# EasyEDA Pro project Space_Hexapod_hw_v1.eprj, board Space_Hexapod
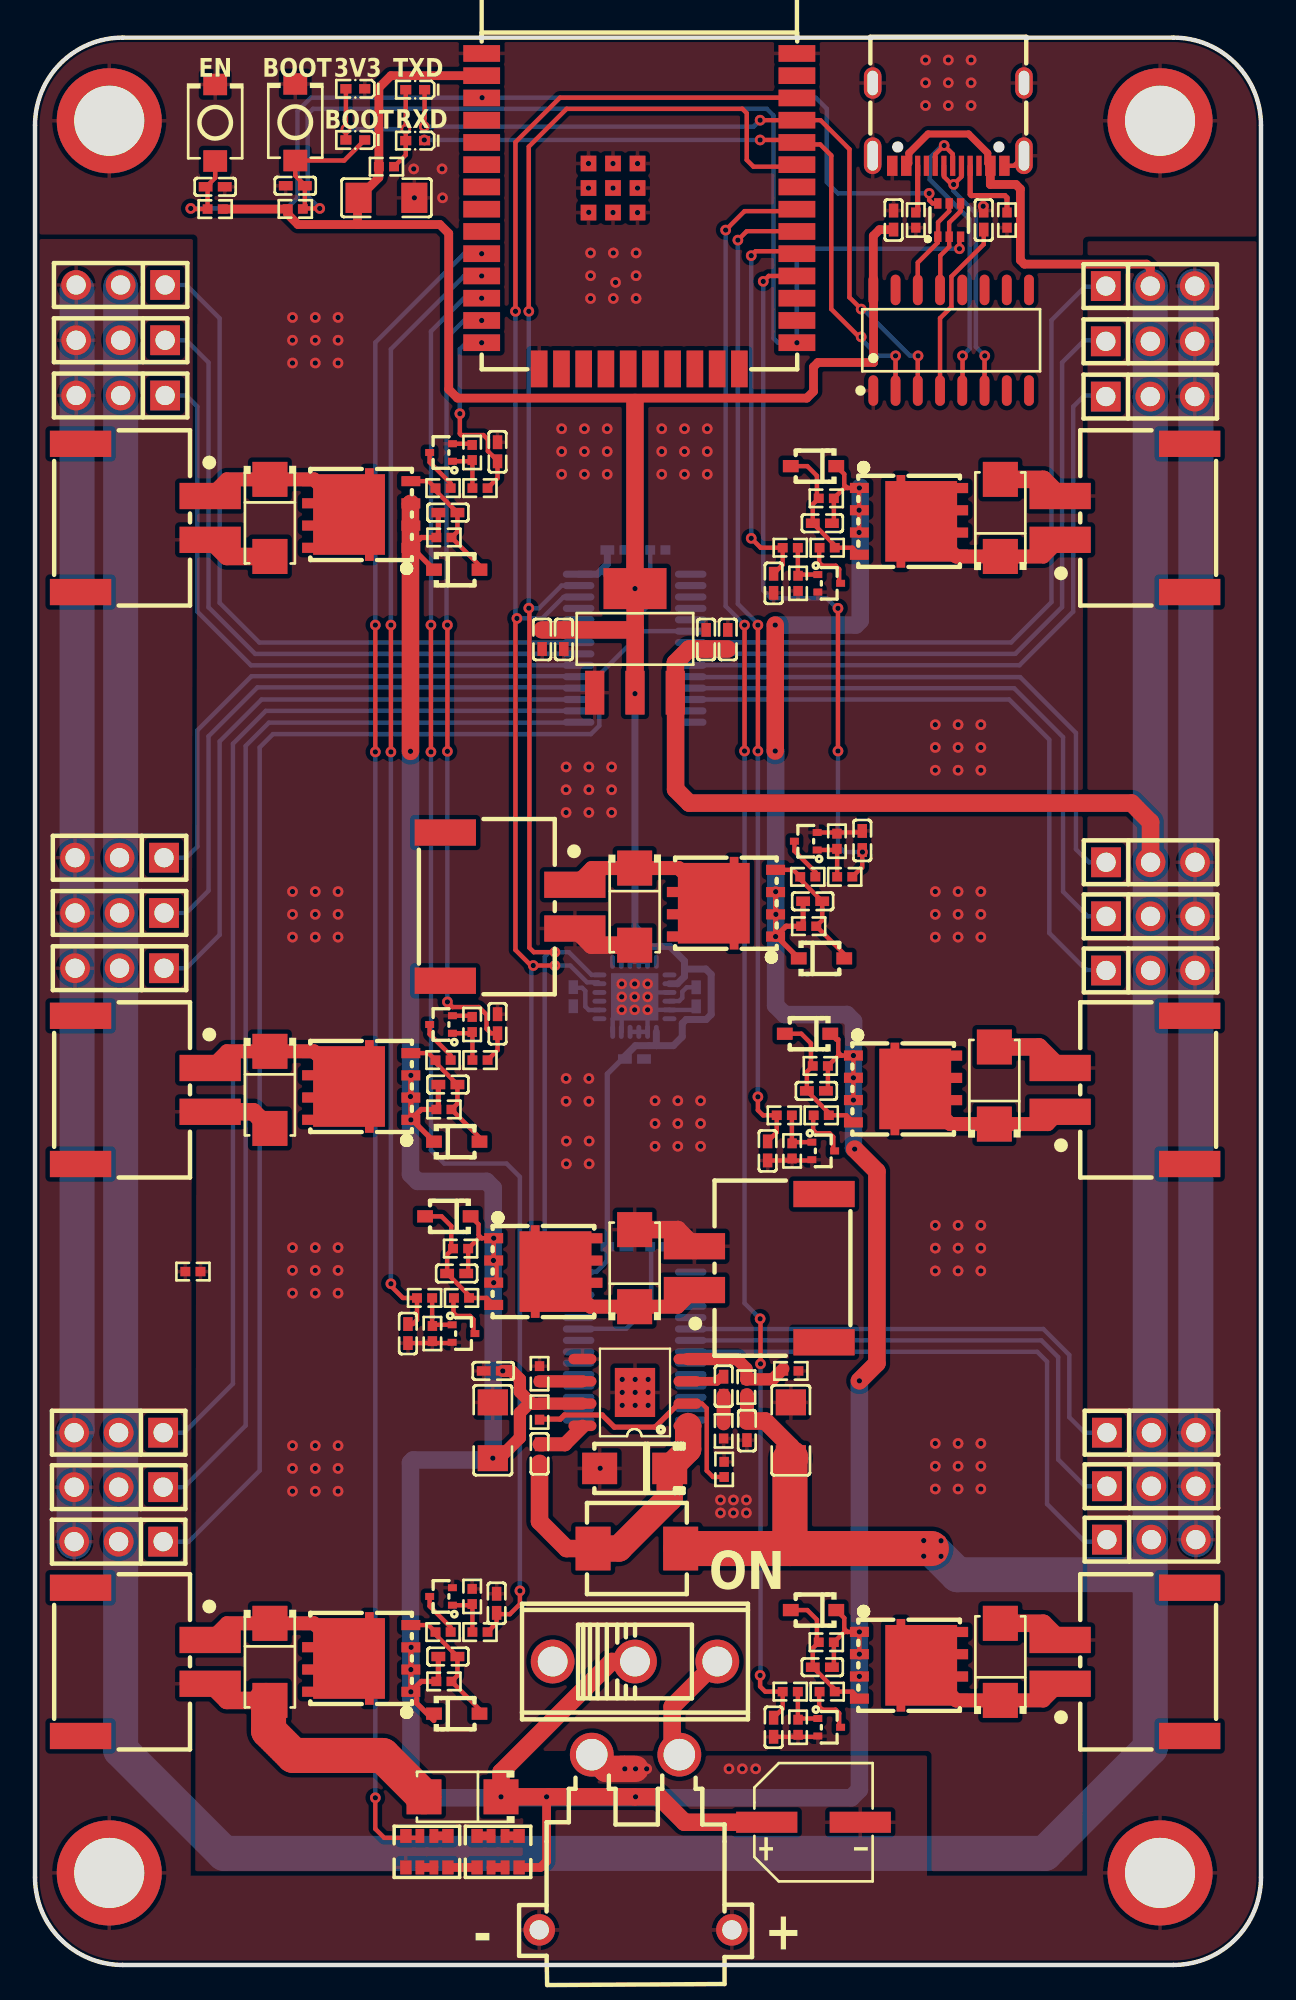
[diagram p1: board, top side]
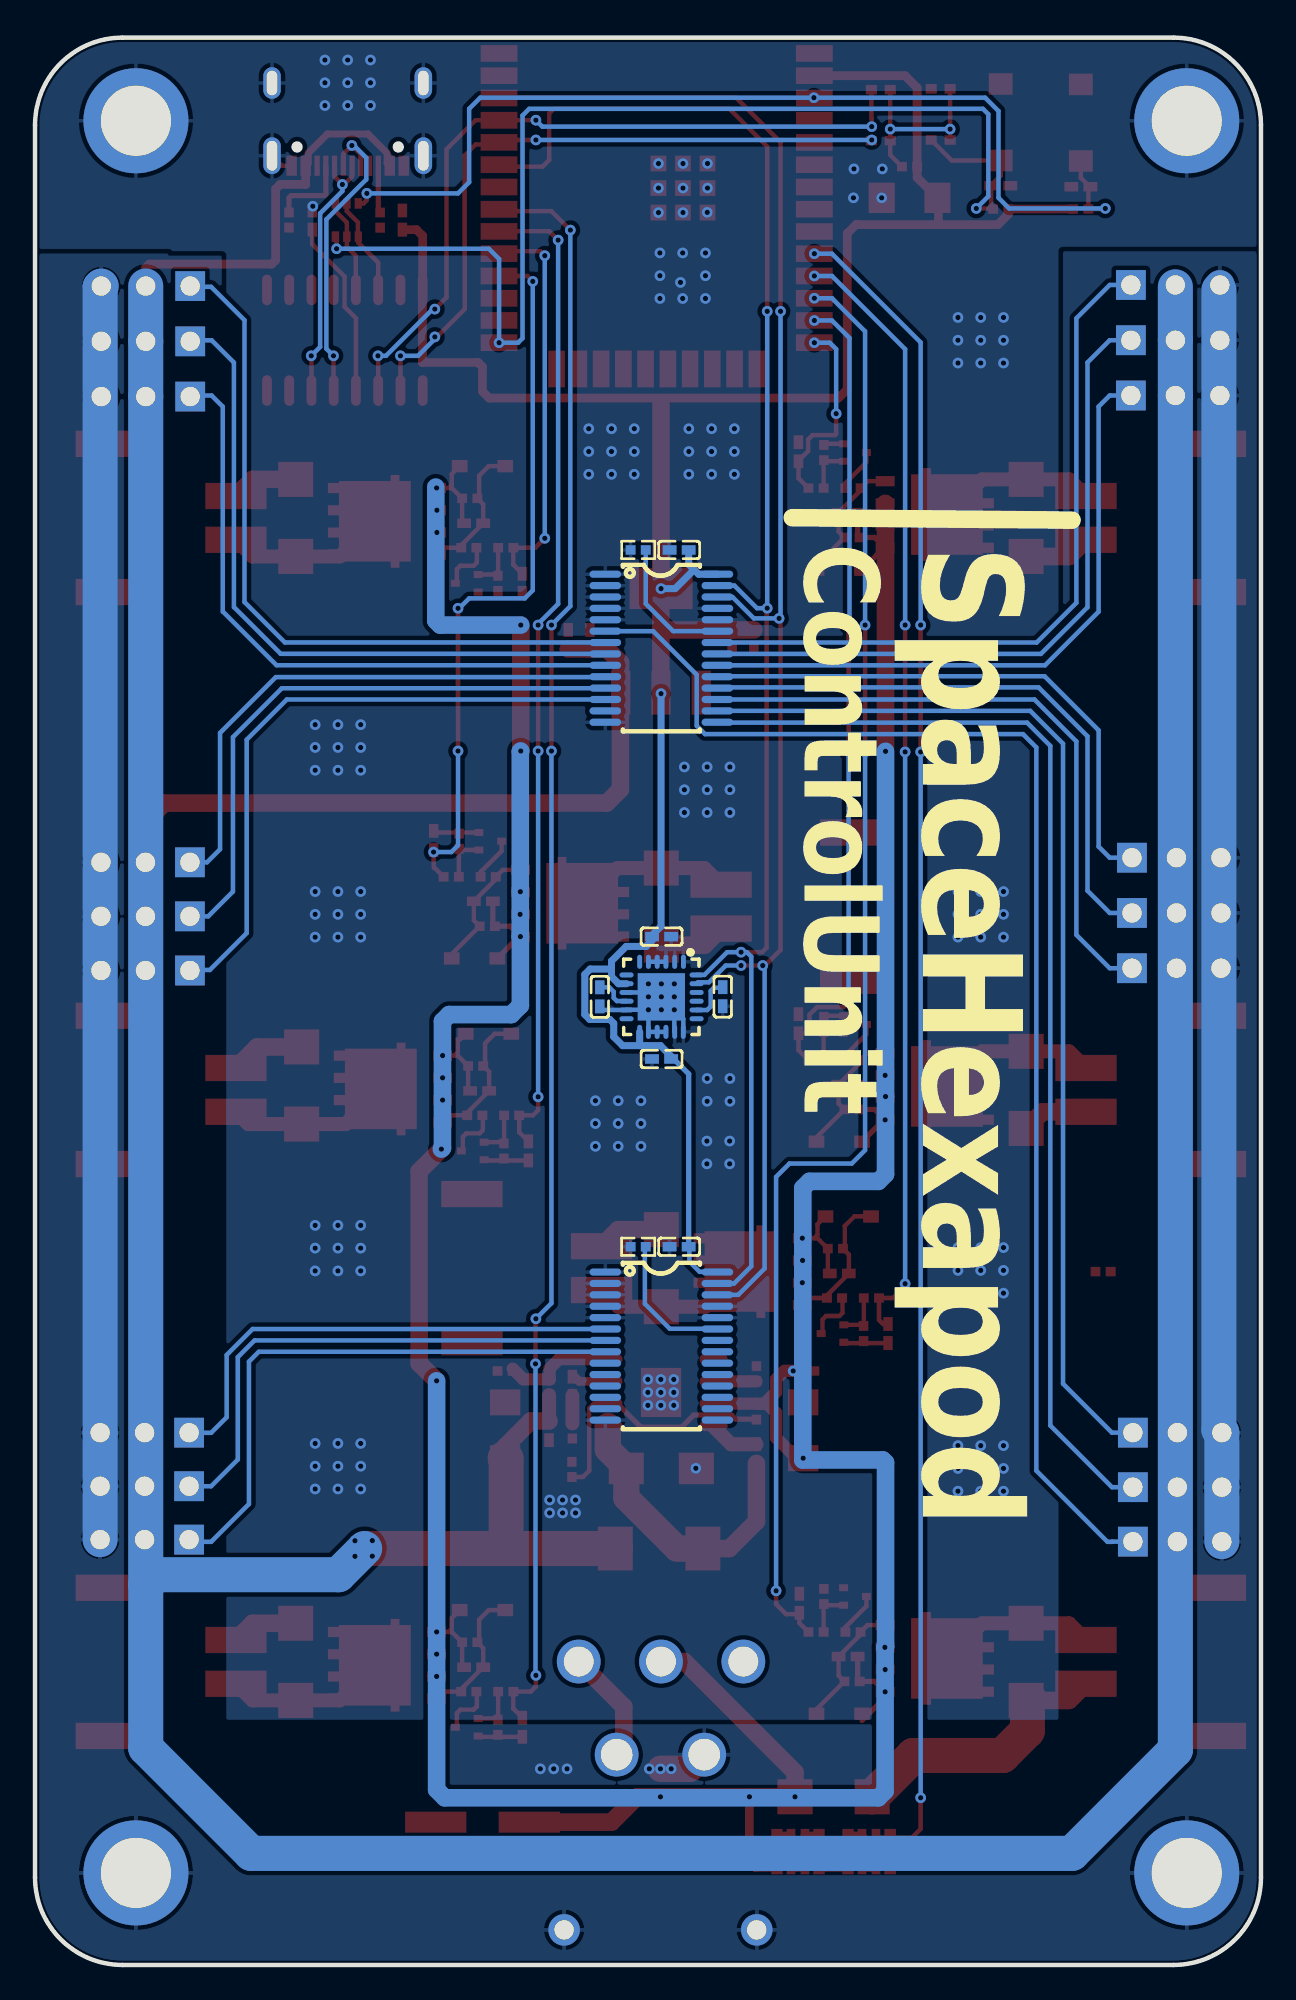
[diagram p2: board, bottom side, seen from below]

Outline 70 x 110 mm; copper layers: Top Layer, Bottom Layer. Coordinates in mm from the lower left corner of the outline.
Outline path: 0,105 0,5 arc(1.46,1.46) 5,0 65,0 arc(68.54,1.46) 70,5 70,105 arc(68.54,108.54) 65,110 5,110 arc(1.46,108.54) 0,105
Stack: Top Layer 0.035mm / Dielectric1 1.51mm FR4 er 4.5 / Bottom Layer 0.035mm

## Design rules (mm)
template: 自定义配置
spacing copperThickness1oz (default): track to track 0.102, other pairs 0.152 to 0.3
spacing copperThickness2oz: track to track 0.203, other pairs 0.152 to 0.3
track width copperThickness1oz (default): min 0.127, default 0.254, max 2.54
track width copperThickness2oz: min 0.203, default 0.254, max 2.54
differential pair differentialPair (default): width min 0.127, default 0.254, max 2.54; gap min 0.152, default 0.152
via viaSize (default): diameter min 0.5, default 0.61, max 10; hole min 0.3, default 0.305, max 6.3

## Placement (name value [footprint] x y rotation side)
3V3  NCD0402G1  [LED0402-RD]  18.29 107.08 180 top
BOOT  NCD0402G1  [LED0402-RD]  18.29 104.16 180 top
BOOT1  TS-1088-AR02016  [SW-SMD_L3.9-W3.0-P4.45]  14.86 105.17 90 top
C1  100pF  [C0402]  39.32 33.03 90 top
C2  10uF  [C0402]  33.22 80.76 180 bottom
C3  100n  [C0402]  28.81 29.17 270 top
C4  100n  [C0402]  40.65 30.5 90 top
C5  10uF  [C1206]  43.16 30.52 90 top
C6  10uF  [C1206]  26.14 30.52 90 top
C7  10uF  [C0402]  38.32 75.65 270 top
C8  100nF  [C0402]  39.56 75.65 270 top
C9  10uF  [C0402]  28.96 75.65 90 top
C10  100nF  [C0402]  30.19 75.65 90 top
C11  100nF  [C0402]  26.16 33.9 0 top
C12  10uF  [C0402]  33.22 40.99 180 bottom
C13  100uF  [CAP-SMD_BD6.3-L6.6-W6.6-LS7.6-FD-1]  44.45 8.15 0 top
C14  1uF  [C0402]  54.17 99.59 270 top
C15  100nF  [C0402]  49.02 99.59 270 top
C16  100nF  [C0402]  26.41 86.36 270 top
C17  100nF  [C0402]  41.83 46.46 90 top
C18  100nF  [C0402]  23.57 82.89 180 top
C19  100nF  [C0402]  44.61 49.89 0 top
C20  100nF  [C0402]  26.41 53.72 270 top
C21  100nF  [C0402]  42.17 13.57 90 top
C22  100nF  [C0402]  23.57 50.25 180 top
C23  100nF  [C0402]  44.96 16.99 0 top
C24  2.2nF  [C0402]  30.73 55.26 270 bottom
C25  10nF  [C0402]  34.23 58.69 180 bottom
C26  100nF  [C0402]  37.75 55.25 90 bottom
C27  100nF  [C0402]  34.23 51.71 180 bottom
C28  100nF  [C0402]  26.36 20.64 270 top
C29  100nF  [C0402]  47.24 64.18 270 top
C30  100nF  [C0402]  23.57 17.6 180 top
C31  100nF  [C0402]  44.4 60.71 180 top
C32  100uF  [C1206]  20.07 100.86 0 top
C33  100nF  [C0402]  14.86 101.54 0 top
C34  100nF  [C0402]  42.17 78.85 90 top
C35  100nF  [C0402]  21.29 36.04 90 top
C36  100nF  [C0402]  10.29 101.48 180 top
C37  100nF  [C0402]  44.96 82.28 0 top
C38  100nF  [C0402]  24.07 39.46 0 top
CN1  XT30PW-M  [CONN-TH_XT30PW-M]  34.29 7 0 top
CN2  ZX-XH2.54-2PWT  [CONN-SMD_2P-P2.54_MEGASTAR_ZX-XH2.54-2PWT]  6.3 82.59 270 top
CN3  ZX-XH2.54-2PWT  [CONN-SMD_2P-P2.54_MEGASTAR_ZX-XH2.54-2PWT]  62.23 49.94 90 top
CN4  ZX-XH2.54-2PWT  [CONN-SMD_2P-P2.54_MEGASTAR_ZX-XH2.54-2PWT]  6.3 49.94 270 top
CN5  ZX-XH2.54-2PWT  [CONN-SMD_2P-P2.54_MEGASTAR_ZX-XH2.54-2PWT]  62.23 17.3 90 top
CN6  ZX-XH2.54-2PWT  [CONN-SMD_2P-P2.54_MEGASTAR_ZX-XH2.54-2PWT]  6.3 17.3 270 top
CN7  ZX-XH2.54-2PWT  [CONN-SMD_2P-P2.54_MEGASTAR_ZX-XH2.54-2PWT]  27.13 60.4 270 top
CN8  ZX-XH2.54-2PWT  [CONN-SMD_2P-P2.54_MEGASTAR_ZX-XH2.54-2PWT]  62.23 82.59 90 top
CN9  ZX-XH2.54-2PWT  [CONN-SMD_2P-P2.54_MEGASTAR_ZX-XH2.54-2PWT]  41.35 39.77 90 top
D1  SS34  [SMA_L4.2-W2.7-LS5.0-RD]  34.24 28.34 180 top
D2  SMAJ26A  [SMA_L4.3-W2.6-LS5.1-RD]  24.41 9.6 180 top
D3  SMAJ26A  [SMA_L4.3-W2.6-LS5.1-RD]  13.41 82.59 270 top
D4  SMAJ26A  [SMA_L4.3-W2.6-LS5.1-RD]  54.78 50.19 90 top
D5  BZT52C10S  [SOD-323_L1.6-W1.3-LS2.7-RD]  24.08 79.63 0 top
D6  BZT52C10S  [SOD-323_L1.6-W1.3-LS2.7-RD]  44.11 53.15 180 top
D7  SMAJ26A  [SMA_L4.3-W2.6-LS5.1-RD]  13.41 49.94 270 top
D8  SMAJ26A  [SMA_L4.3-W2.6-LS5.1-RD]  55.12 17.3 90 top
D9  BZT52C10S  [SOD-323_L1.6-W1.3-LS2.7-RD]  24.08 46.99 0 top
D10  BZT52C10S  [SOD-323_L1.6-W1.3-LS2.7-RD]  44.45 20.25 180 top
D11  SMAJ26A  [SMA_L4.3-W2.6-LS5.1-RD]  13.41 17.3 270 top
D12  SMAJ26A  [SMA_L4.3-W2.6-LS5.1-RD]  34.24 60.4 270 top
D13  BZT52C10S  [SOD-323_L1.6-W1.3-LS2.7-RD]  24.08 14.34 0 top
D14  BZT52C10S  [SOD-323_L1.6-W1.3-LS2.7-RD]  44.91 57.45 0 top
D15  SMAJ26A  [SMA_L4.3-W2.6-LS5.1-RD]  55.12 82.59 90 top
D16  SMAJ26A  [SMA_L4.3-W2.6-LS5.1-RD]  34.24 39.77 90 top
D17  BZT52C10S  [SOD-323_L1.6-W1.3-LS2.7-RD]  44.45 85.54 180 top
D18  BZT52C10S  [SOD-323_L1.6-W1.3-LS2.7-RD]  23.57 42.72 180 top
EN  TS-1088-AR02016  [SW-SMD_L3.9-W3.0-P4.45]  10.29 105.14 90 top
H1  PZ254V-11-03P  [HDR-TH_3P-P2.54-V-M]  4.89 95.88 180 top
H2  PZ254V-11-03P  [HDR-TH_3P-P2.54-V-M]  4.83 63.19 180 top
H3  PZ254V-11-03P  [HDR-TH_3P-P2.54-V-M]  4.78 30.38 180 top
H4  PZ254V-11-03P  [HDR-TH_3P-P2.54-V-M]  4.89 92.73 180 top
H5  PZ254V-11-03P  [HDR-TH_3P-P2.54-V-M]  4.83 60.04 180 top
H6  PZ254V-11-03P  [HDR-TH_3P-P2.54-V-M]  4.78 27.27 180 top
H7  PZ254V-11-03P  [HDR-TH_3P-P2.54-V-M]  4.89 89.57 180 top
H8  PZ254V-11-03P  [HDR-TH_3P-P2.54-V-M]  4.83 56.89 180 top
H9  PZ254V-11-03P  [HDR-TH_3P-P2.54-V-M]  4.78 24.16 180 top
H10  PZ254V-11-03P  [HDR-TH_3P-P2.54-V-M]  63.68 95.82 0 top
H11  PZ254V-11-03P  [HDR-TH_3P-P2.54-V-M]  63.69 62.93 0 top
H12  PZ254V-11-03P  [HDR-TH_3P-P2.54-V-M]  63.74 30.38 0 top
H13  PZ254V-11-03P  [HDR-TH_3P-P2.54-V-M]  63.68 92.67 0 top
H14  PZ254V-11-03P  [HDR-TH_3P-P2.54-V-M]  63.69 59.85 0 top
H15  PZ254V-11-03P  [HDR-TH_3P-P2.54-V-M]  63.74 27.32 0 top
H16  PZ254V-11-03P  [HDR-TH_3P-P2.54-V-M]  63.68 89.51 0 top
H17  PZ254V-11-03P  [HDR-TH_3P-P2.54-V-M]  63.69 56.76 0 top
H18  PZ254V-11-03P  [HDR-TH_3P-P2.54-V-M]  63.74 24.27 0 top
L1  4.7uH  [IND-SMD_L5.9-W5.2]  34.37 23.77 0 top
NOREF  -  [Pad_e6110]  4.24 105.25 0 top
NOREF#2  -  [Pad_e6116]  4.24 5.25 0 top
NOREF#3  -  [Pad_e6117]  64.24 5.25 0 top
NOREF#4  -  [Pad_e6115]  64.24 105.25 0 top
Q1  UMH3N  [SC-70-6_L2.2-W1.3-P0.65-LS2.1-BR]  52.2 99.59 270 top
Q2  HYG110P04LQ2C2  [PDFN-8_L5.2-W5.9-P1.27-LS6.2-BL]  18.62 82.78 90 top
Q3  HYG110P04LQ2C2  [PDFN-8_L5.2-W5.9-P1.27-LS6.2-BL]  49.56 50 270 top
Q4  MMBT3904T  [SOT-523-3_L1.6-W0.8-P1.00-LS1.6-BR]  23.18 86.32 0 top
Q5  MMBT3904T  [SOT-523-3_L1.6-W0.8-P1.00-LS1.6-BR]  45.01 46.46 180 top
Q6  HYG110P04LQ2C2  [PDFN-8_L5.2-W5.9-P1.27-LS6.2-BL]  18.62 50.14 90 top
Q7  HYG110P04LQ2C2  [PDFN-8_L5.2-W5.9-P1.27-LS6.2-BL]  49.9 17.1 270 top
Q8  MMBT3904T  [SOT-523-3_L1.6-W0.8-P1.00-LS1.6-BR]  23.18 53.68 0 top
Q9  MMBT3904T  [SOT-523-3_L1.6-W0.8-P1.00-LS1.6-BR]  45.35 13.57 180 top
Q10  HYG110P04LQ2C2  [PDFN-8_L5.2-W5.9-P1.27-LS6.2-BL]  18.62 17.49 90 top
Q11  HYG110P04LQ2C2  [PDFN-8_L5.2-W5.9-P1.27-LS6.2-BL]  39.45 60.6 90 top
Q12  MMBT3904T  [SOT-523-3_L1.6-W0.8-P1.00-LS1.6-BR]  23.18 21.03 0 top
Q13  MMBT3904T  [SOT-523-3_L1.6-W0.8-P1.00-LS1.6-BR]  44.01 64.13 0 top
Q14  HYG110P04LQ2C2  [PDFN-8_L5.2-W5.9-P1.27-LS6.2-BL]  49.9 82.39 270 top
Q15  HYG110P04LQ2C2  [PDFN-8_L5.2-W5.9-P1.27-LS6.2-BL]  29.02 39.57 270 top
Q16  MMBT3904T  [SOT-523-3_L1.6-W0.8-P1.00-LS1.6-BR]  45.35 78.85 180 top
Q17  MMBT3904T  [SOT-523-3_L1.6-W0.8-P1.00-LS1.6-BR]  24.47 36.04 180 top
R1  100k  [R0402]  39.32 30.48 270 top
R2  10kΩ  [R0402]  35.56 80.76 0 bottom
R3  8.2k  [R0402]  43.16 33.9 0 top
R4  100kΩ  [R0402]  28.81 33.74 90 top
R5  100kΩ  [R0402]  28.81 31.55 90 top
R6  100kΩ  [R0402]  39.35 28.28 90 top
R7  44.2kΩ  [R0402]  40.62 32.98 270 top
R8  10kΩ  [R0402]  35.56 40.99 0 bottom
R9  0Ω  [R0402]  9.02 39.57 0 top
R10  5kΩ  [R0402]  55.5 99.59 270 top
R11  5kΩ  [R0402]  50.29 99.59 270 top
R12  1kΩ  [R0402]  25.41 84.29 0 top
R13  1kΩ  [R0402]  42.78 48.49 180 top
R14  10kΩ  [R0402]  24.96 86.32 270 top
R15  10kΩ  [R0402]  43.23 46.46 90 top
R16  10kΩ  [R0402]  23.35 81.47 180 top
R17  10kΩ  [R0402]  44.84 51.31 0 top
R18  10kΩ  [R0402]  23.3 84.29 180 top
R19  10kΩ  [R0402]  44.89 48.49 0 top
R20  1kΩ  [R0402]  25.41 51.64 0 top
R21  1kΩ  [R0402]  43.12 15.6 180 top
R22  10kΩ  [R0402]  24.96 53.68 270 top
R23  10kΩ  [R0402]  43.57 13.57 90 top
R24  10kΩ  [R0402]  23.35 48.83 180 top
R25  10kΩ  [R0402]  45.18 18.42 0 top
R26  10kΩ  [R0402]  23.3 51.64 180 top
R27  10kΩ  [R0402]  45.23 15.6 0 top
R28  1kΩ  [R0402]  25.41 19 0 top
R29  1kΩ  [R0402]  46.23 62.1 0 top
R30  10kΩ  [R0402]  24.96 21.03 270 top
R31  10kΩ  [R0402]  45.79 64.13 270 top
R32  10kΩ  [R0402]  23.35 16.18 180 top
R33  10kΩ  [R0402]  44.18 59.28 180 top
R34  10kΩ  [R0402]  23.3 19 180 top
R35  10kΩ  [R0402]  44.12 62.1 180 top
R36  1kΩ  [R0402]  14.86 100.22 0 top
R37  1kΩ  [R0402]  20.07 102.63 0 top
R38  1kΩ  [R0402]  43.12 80.89 180 top
R39  1kΩ  [R0402]  22.24 38.07 180 top
R40  1kΩ  [R0402]  10.29 100.21 180 top
R41  10kΩ  [R0402]  43.57 78.85 90 top
R42  10kΩ  [R0402]  22.69 36.04 90 top
R43  10kΩ  [R0402]  45.18 83.7 0 top
R44  10kΩ  [R0402]  24.3 40.89 0 top
R45  10kΩ  [R0402]  45.23 80.89 0 top
R46  10kΩ  [R0402]  24.35 38.07 0 top
RN1  1kΩ  [RES-ARRAY-SMD_0603-8P-L3.2-W1.6-BL]  26.44 6.47 180 top
RN2  1kΩ  [RES-ARRAY-SMD_0603-8P-L3.2-W1.6-BL]  22.38 6.47 180 top
RXD  NCD0402G1  [LED0402-RD]  21.71 104.12 180 top
SW1  K3-1391D-5MM  [SW-TH_K3-1391D-5MM]  34.26 17.32 0 top
TXD  NCD0402G1  [LED0402-RD]  21.71 107.03 180 top
U1  PCA9685PW,118  [TSSOP-28_L9.7-W4.4-P0.65-LS6.4-TL]  34.24 75.15 180 bottom
U2  MP1584EN-LF-P  [SOIC-8_L4.9-W3.9-P1.27-LS6.0-TL-EP-1]  34.24 32.66 180 top
U3  AMS1117-3.3  [SOT-223-3_L6.5-W3.4-P2.30-LS7.0-BR]  34.26 75.58 270 top
U4  PCA9685PW,118  [TSSOP-28_L9.7-W4.4-P0.65-LS6.4-TL]  34.24 35.32 180 bottom
U5  CH340C  [SOP-16_L10.0-W3.9-P1.27-LS6.0-BL]  52.31 92.73 0 top
U6  ESP32-WROOM-32E-N8  [WIFI-SMD_ESP32-WROOM-32E]  34.5 100.09 270 top
U7  MPU-6050  [QFN-24_L4.0-W4.0-P0.50-BL-EP2.7]  34.23 55.25 0 bottom
USB1  TYPE-C16PIN  [USB-C-SMD_TYPE-C16PIN]  52.15 105.05 180 top

## Footprints (pads in the part's own frame, mm; a bottom-side part is the same pattern mirrored in y, then rotated)
C0402
  rect 0.79x0.54 smd: 1(-0.545,0) 2(0.545,0)
C1206
  rect 1.485x1.728 smd: 1(-1.593,0) 2(1.593,0)
CAP-SMD_BD6.3-L6.6-W6.6-LS7.6-FD-1
  rect 3.5x1.2 smd: 1(-2.67,0) 2(2.67,0)
CONN-SMD_2P-P2.54_MEGASTAR_ZX-XH2.54-2PWT
  rect 1.5x3.5 smd: 1(-1.25,3.7) 2(1.25,3.7) 3(-4.23,-3.7) 4(4.23,-3.7)
CONN-TH_XT30PW-M
  round 2.5 hole 1.8: 1(-2.5,5) 2(2.5,5)
  round 1.8 hole 1.1: 3(5.5,-5) 4(-5.5,-5)
HDR-TH_3P-P2.54-V-M
  rect 1.7x1.7 hole 1.1: 1(-2.54,0)
  round 1.7 hole 1.1: 2(0,0) 3(2.54,0)
IND-SMD_L5.9-W5.2
  rect 2x2.5 smd: 1(-2.5,0) 2(2.5,0)
LED0402-RD
  rect 0.636x0.54 smd: 1(-0.538,0) 2(0.538,0)
Pad_e6110
  round 6 hole 4: 1(0,0)
Pad_e6115
  round 6 hole 4: 2(0,0)
Pad_e6116
  round 6 hole 4: 3(0,0)
Pad_e6117
  round 6 hole 4: 4(0,0)
PDFN-8_L5.2-W5.9-P1.27-LS6.2-BL
  rect 0.58x1.079 smd: 1(-1.905,-2.834) 2(-0.635,-2.834) 3(0.635,-2.834) 4(1.905,-2.834)
  rect 0.58x1.08 smd: 5(1.91,2.834) 6(0.64,2.834) 7(-0.63,2.834) 8(-1.9,2.834)
  rect 0.95x0.5 smd: 9(-2.169,-0.465) 9(2.169,-0.465)
  rect 4.6x4.1 smd: 9(0,0.695)
QFN-24_L4.0-W4.0-P0.50-BL-EP2.7
  oval 0.28x0.8 smd: 1(-1.25,-2) 2(-0.75,-2) 3(-0.25,-2) 4(0.25,-2) 5(0.75,-2) 6(1.25,-2) 13(1.25,2) 14(0.75,2) 15(0.25,2) 16(-0.25,2) 17(-0.75,2) 18(-1.242,2)
  oval 0.8x0.28 smd: 7(2,-1.25) 8(2,-0.75) 9(2,-0.25) 10(2,0.25) 11(2,0.75) 12(2,1.25) 19(-2,1.25) 20(-2,0.75) 21(-2,0.25) 22(-2,-0.25) 23(-2,-0.75) 24(-2,-1.25)
  rect 2.7x2.7 smd: 25(0.013,0)
R0402
  rect 0.566x0.54 smd: 1(-0.433,0) 2(0.433,0)
RES-ARRAY-SMD_0603-8P-L3.2-W1.6-BL
  rect 0.65x0.8 smd: 1(-1.2,-0.9) 4(1.2,-0.9) 5(1.2,0.9) 8(-1.2,0.9)
  rect 0.5x0.8 smd: 2(-0.4,-0.9) 3(0.4,-0.9) 6(0.4,0.9) 7(-0.4,0.9)
SC-70-6_L2.2-W1.3-P0.65-LS2.1-BR
  rect 0.6x0.42 smd: 1(0.95,-0.65) 2(0.95,0) 3(0.95,0.65) 4(-0.95,0.65) 5(-0.95,0) 6(-0.95,-0.65)
SMA_L4.2-W2.7-LS5.0-RD
  rect 2x1.8 smd: 1(-2,0) 2(2,0)
SMA_L4.3-W2.6-LS5.1-RD
  rect 2x2 smd: 1(-2.2,0) 2(2.2,0)
SOD-323_L1.6-W1.3-LS2.7-RD
  rect 0.9x0.7 smd: 1(-1.3,0) 2(1.3,0)
SOIC-8_L4.9-W3.9-P1.27-LS6.0-TL-EP-1
  oval 1.6x0.6 smd: 1(-3.018,1.887) 2(-3.018,0.617) 3(-3.018,-0.653) 4(-3.018,-1.923) 5(2.982,-1.923) 6(2.982,-0.653) 7(2.982,0.617) 8(2.982,1.887)
  rect 2.3x2.8 smd: 9(-0.018,-0.018)
SOP-16_L10.0-W3.9-P1.27-LS6.0-BL
  oval 0.56x1.745 smd: 1(-4.445,-2.873) 2(-3.175,-2.873) 3(-1.905,-2.873) 4(-0.635,-2.873) 5(0.635,-2.873) 6(1.905,-2.873) 7(3.175,-2.873) 8(4.445,-2.873) 9(4.445,2.873) 10(3.175,2.873) 11(1.905,2.873) 12(0.635,2.873) 13(-0.635,2.873) 14(-1.905,2.873) 15(-3.175,2.873) 16(-4.445,2.873)
SOT-223-3_L6.5-W3.4-P2.30-LS7.0-BR
  rect 2.5x1.1 smd: 1(2.97,-2.3) 2(2.97,0) 3(2.97,2.3)
  rect 2.34x3.6 smd: 4(-2.97,0)
SOT-523-3_L1.6-W0.8-P1.00-LS1.6-BR
  rect 0.51x0.4 smd: 1(0.65,-0.5) 2(0.65,0.5) 3(-0.65,0)
SW-SMD_L3.9-W3.0-P4.45
  rect 1.23x1.36 smd: 1(-2.185,0) 2(2.185,0)
SW-TH_K3-1391D-5MM
  round 2.5 hole 1.7: 1(-4.7,0) 2(0,0) 3(4.7,0)
TSSOP-28_L9.7-W4.4-P0.65-LS6.4-TL
  oval 1.804x0.406 smd: 1(-3.2,4.225) 2(-3.2,3.575) 3(-3.2,2.925) 4(-3.2,2.275) 5(-3.2,1.625) 6(-3.2,0.975) 7(-3.2,0.325) 8(-3.2,-0.325) 9(-3.2,-0.975) 10(-3.2,-1.625) 11(-3.2,-2.275) 12(-3.2,-2.925) 13(-3.2,-3.575) 14(-3.2,-4.225) 15(3.2,-4.225) 16(3.2,-3.575) 17(3.2,-2.925) 18(3.2,-2.275) 19(3.2,-1.625) 20(3.2,-0.975) 21(3.2,-0.325) 22(3.2,0.325) 23(3.2,0.975) 24(3.2,1.625) 25(3.2,2.275) 26(3.2,2.925) 27(3.2,3.575) 28(3.2,4.225)
USB-C-SMD_TYPE-C16PIN
  oval 1x2.1 hole 0.6x1.7: 1(-4.32,1.788) 2(4.32,1.788)
  oval 1x1.8 hole 0.6x1.4: 3(-4.32,-2.362) 4(4.32,-2.362)
  rect 0.6x1.15 smd: A1B12(-3.2,2.362) A4B9(-2.4,2.362) B1A12(3.2,2.362) B4A9(2.4,2.362)
  rect 0.3x1.15 smd: A5(-1.25,2.362) A6(-0.25,2.362) A7(0.25,2.362) A8(1.25,2.362) B5(1.75,2.362) B6(0.75,2.362) B7(-0.75,2.362) B8(-1.75,2.362)
WIFI-SMD_ESP32-WROOM-32E
  rect 0.95x2.1 smd: 1(-9.002,-9) 2(-7.732,-9) 3(-6.463,-9) 4(-5.192,-9) 5(-3.922,-9) 6(-2.652,-9) 7(-1.383,-9) 8(-0.113,-9) 9(1.157,-9) 10(2.428,-9) 11(3.697,-9) 12(4.968,-9) 13(6.237,-9) 14(7.508,-9) 25(7.508,9) 26(6.237,9) 27(4.968,9) 28(3.697,9) 29(2.428,9) 30(1.157,9) 31(-0.113,9) 32(-1.383,9) 33(-2.652,9) 34(-3.922,9) 35(-5.192,9) 36(-6.463,9) 37(-7.732,9) 38(-9.002,9)
  rect 2.1x0.95 smd: 15(9.002,-5.715) 16(9.002,-4.445) 17(9.002,-3.175) 18(9.002,-1.905) 19(9.002,-0.635) 20(9.002,0.635) 21(9.002,1.905) 22(9.002,3.175) 23(9.002,4.445) 24(9.002,5.715)
  rect 0.9x0.9 smd: 39(-2.721,-0.1) 39(-2.721,-1.5) 39(-2.721,-2.9) 39(-1.321,-0.1) 39(-1.321,-1.5) 39(-1.321,-2.9) 39(0.079,-0.1) 39(0.079,-1.5) 39(0.079,-2.9)

## Nets
As in the schematic, except:
GND: 3V3.1 BOOT1.2 C2.1 C4.1 C5.2 C6.2 C7.1 C8.1 C9.1 C10.1 C11.1 C12.1 C14.1 C15.1 C16.1 C17.1 C20.1 C21.1 C24.2 C25.2 C26.1 C27.1 C28.1 C29.1 C32.2 C33.1 C34.1 C35.1 C36.1 CN7.2 CN9.2 D1.2 D12.2 D16.2 EN.2 NOREF.1 NOREF#4.2 Q4.2 Q5.2 Q8.2 Q9.2 Q12.2 Q13.2 Q16.2 Q17.2 R1.2 R2.2 R3.2 R4.2 R6.2 R8.2 R9.2 R10.2 R11.2 R14.1 R15.1 R22.1 R23.1 R30.1 R31.1 R41.1 R42.1 RN2.5 U1.1 U1.2 U1.3 U1.4 U1.5 U1.14 U1.24 U1.25 U2.5 U2.9 U3.1 U4.1 U4.2 U4.3 U4.4 U4.5 U4.14 U4.24 U4.25 U5.1 U6.1 U6.15 U6.38 U6.39 U7.1 U7.2 U7.3 U7.4 U7.5 U7.9 U7.11 U7.14 U7.15 U7.16 U7.17 U7.18 U7.25 USB1.1 USB1.2 USB1.3 USB1.4 USB1.A1B12 USB1.B1A12
PGND: C13.2 CN1.1 CN1.3 CN1.4 CN2.2 CN3.2 CN4.2 CN5.2 CN6.2 CN8.2 D2.2 D3.2 D4.2 D7.2 D8.2 D11.2 D15.2 H1.3 H2.3 H3.3 H4.3 H5.3 H6.3 H7.3 H8.3 H9.3 H10.3 H11.3 H12.3 H13.3 H14.3 H15.3 H16.3 H17.3 H18.3 NOREF#2.3 NOREF#3.4 R9.1

Pads without a net: CN2 3 4; CN3 3 4; CN4 3 4; CN5 3 4; CN6 3 4; CN7 3 4; CN8 3 4; CN9 3 4; SW1 1; U1 13; U4 9 10 11 12 13 15 16 17 18 19 20 21 22; U5 7 8 9 10 11 12 15; U6 4 5 6 7 8 9 16 17 18 19 20 21 22 23 24 26 27 32 37; U7 6 7 12 19 21 22; USB1 A8 B8

## Via types
v1: diameter 0.61, hole 0.305, Top Layer to Bottom Layer, 277 vias

## Routing (per net, layer and track width the routed paths; a pad name or vN(x,y) marks a point on that pad's centre or on a via; arc(x,y) is an arc through that point)
3V3: length 142.2
  Top Layer w0.5: 18.41,99.33 18.41,100.63 ; 18.41,99.33 23.11,99.33 23.62,98.82 23.62,89.93 24.12,89.43 44.07,89.43 44.45,89.81 44.45,91.2 44.7,91.46 47.88,91.46 47.88,95.59 U5.16 47.87,98.68 48.22,99.04 C15.2 ; 18.41,99.33 15.02,99.33 14.43,99.92 R36.1 14.42,100.21 R40.1 ; C32.1 19.63,102.02 R37.1 19.63,107.14 20.32,107.83 U6.2
  Top Layer w1: 34.27,76.2 34.27,78.54 v1(34.26,78.55) 34.26,89.17 ; 34.27,76.2 C10.2 C9.2 ; 34.27,76.2 34.27,72.61
  Bottom Layer w0.254: 32.61,40.94 32.62,40.94 ; 32.64,40.92 32.64,40.15 32.05,39.56 30.98,39.56
  Bottom Layer w0.3: C12.2 32.68,50.86 33.53,51.71
  Bottom Layer w0.4: 35.48,52.47 36.45,52.47 36.96,52.98 36.96,53.74 37.18,53.96 38.32,53.96 38.61,54.25 38.61,56.53 38.3,56.84 37.08,56.84 ; 35.48,52.47 U7.13 ; 35.48,52.47 34.28,52.47 33.6,51.79 ; 37.08,56.84 37.08,57.29 36.25,58.13 35.1,58.13 34.77,58.47 C25.1 ; 37.08,56.84 37.08,56.41 36.68,56 U7.8 ; C2.2 32.68,79.94 32.37,79.63 ; 34.77,58.76 34.26,59.28 v1(34.26,72.56) ; v1(34.26,78.55) 33.45,78.55 32.37,79.63 ; 32.37,79.63 32.11,79.37 U1.28
5V: length 332.1
  Top Layer w0.4: USB1.A4B9 54.4,102.83 54.4,103.41 53.3,104.5 50.99,104.5 49.9,103.41 49.9,102.83 USB1.B4A9
  Top Layer w0.5: H10.2 63.68,96.87 63.47,97.07 56.49,97.07 56.26,97.3 56.26,101.36 56.01,101.62 54.55,101.62 USB1.A4B9
  Top Layer w0.8: C4.2 40.65,32.52
  Top Layer w1: 36.57,72.61 36.57,74.33 37.34,75.11 C7.2 C8.2 ; U3.3 36.58,72.59 36.58,67.09 37.36,66.31 62.61,66.31 63.69,65.23 H11.2 ; C5.1 43.16,29.58 41.69,31.04 C4.2
  Top Layer w2: C5.1 43.1,28.87 43.1,23.77 ; 43.1,23.77 L1.2 ; 43.1,23.77 51.18,23.77
  Bottom Layer w2: 4.89,95.78 H4.2 H7.2 4.89,12.27 10.8,6.37 57.66,6.37 63.68,12.39 63.68,21.68 ; 63.68,21.68 63.08,22.27 52.68,22.27 51.18,23.77 ; 63.68,21.68 H16.2 H13.2 H10.2
  vias: v1(50.74,24.22) v1(50.74,23.33) v1(51.73,24.21) v1(51.73,23.32)
GND: length 32.4
  Top Layer w0.254: Q5.2 44.31,45.91 C17.1 ; 24.96,86.75 24.89,86.82 Q4.2 ; Q9.2 44.65,13.02 C21.1 ; 47.24,64.72 47.15,64.63 Q13.2 ; 21.29,35.49 23.77,35.49 Q17.2 ; USB1.1 55.89,102.68 USB1.A1B12 ; 24.96,54.11 24.89,54.18 Q8.2
  Top Layer w1: D12.2 31.78,58.2 CN7.2 ; CN9.2 36.7,41.97 D16.2
  Bottom Layer w0.254: v1(34.98,55.25) 35.23,55.5 U7.9 ; 33.98,54.25 v1(34.24,54.51) 34.48,54.28 ; U7.5 U7.4 U7.3 ; U7.17 33.5,53.28 v1(33.5,54.51) 32.98,54 U7.18 ; U7.16 U7.15 U7.14 34.98,54.51 v1(34.98,54.51) 36.22,54.51 U7.11 37.55,54.5 C26.1
  vias: v1(14.7,94.03) v1(14.7,92.73) v1(14.7,91.43) v1(14.7,61.26) v1(14.7,59.96) v1(14.7,58.66) v1(14.7,40.94) v1(14.7,39.64) v1(14.7,38.34) v1(14.7,29.64) v1(14.7,28.34) v1(14.7,27.04) v1(16,94.03) v1(16,92.73) v1(16,91.43) v1(16,61.26) v1(16,59.96) v1(16,58.66) v1(16,40.94) v1(16,39.64) v1(16,38.34) v1(16,29.64) v1(16,28.34) v1(16,27.04) v1(17.3,94.03) v1(17.3,92.73) v1(17.3,91.43) v1(17.3,61.26) v1(17.3,59.96) v1(17.3,58.66) v1(17.3,40.94) v1(17.3,39.64) v1(17.3,38.34) v1(17.3,29.64) v1(17.3,28.34) v1(17.3,27.04) v1(21.62,102.51) v1(21.66,100.86) v1(23.24,102.51) v1(23.27,100.86) v1(30.07,87.68) v1(30.07,86.38) v1(30.07,85.08) v1(30.32,68.37) v1(30.32,67.07) v1(30.32,65.77) v1(30.32,50.59) v1(30.32,49.29) v1(30.34,47.02) v1(30.34,45.72) v1(31.37,87.68) v1(31.37,86.38) v1(31.37,85.08) v1(31.6,102.82) v1(31.6,101.41) v1(31.62,100.03) v1(31.62,68.37) v1(31.62,67.07) v1(31.62,65.77) v1(31.62,50.59) v1(31.62,49.29) v1(31.64,47.02) v1(31.64,45.72) v1(31.72,97.71) v1(31.72,96.41) v1(31.72,95.11) v1(32.27,28.35) v1(32.67,87.68) v1(32.67,86.38) v1(32.67,85.08) v1(32.92,68.37) v1(32.92,67.07) v1(32.92,65.77) v1(33,102.81) v1(33,101.41) v1(33,100.02) v1(33.02,97.71) v1(33.02,95.11) v1(33.15,96.03) v1(33.5,55.99) v1(33.5,55.25) v1(33.53,33.42) v1(33.53,32.68) v1(33.53,31.94) v1(34.24,55.99) v1(34.24,55.25) v1(34.27,33.42) v1(34.27,32.68) v1(34.27,31.94) v1(34.32,97.71) v1(34.32,96.41) v1(34.32,95.11) v1(34.4,102.81) v1(34.4,101.41) v1(34.4,100.01) v1(34.98,55.99) v1(35.01,33.42) v1(35.01,32.68) v1(35.01,31.94) v1(35.4,49.32) v1(35.4,48.02) v1(35.4,46.72) v1(35.78,87.68) v1(35.78,86.38) v1(35.78,85.08) v1(36.7,49.32) v1(36.7,48.02) v1(36.7,46.72) v1(37.08,87.68) v1(37.08,86.38) v1(37.08,85.08) v1(38,49.32) v1(38,48.02) v1(38,46.72) v1(38.38,87.68) v1(38.38,86.38) v1(38.38,85.08) v1(39.14,26.54) v1(39.14,25.8) v1(39.88,26.54) v1(39.88,25.8) v1(40.62,26.54) v1(40.62,25.8) v1(50.85,108.72) v1(50.85,107.42) v1(50.85,106.12) v1(51.41,70.79) v1(51.41,69.49) v1(51.41,68.19) v1(51.41,61.26) v1(51.41,59.96) v1(51.41,58.66) v1(51.41,42.21) v1(51.41,40.91) v1(51.41,39.61) v1(51.41,29.77) v1(51.41,28.47) v1(51.41,27.17) v1(52.15,108.72) v1(52.15,107.42) v1(52.15,106.12) v1(52.71,70.79) v1(52.71,69.49) v1(52.71,68.19) v1(52.71,61.26) v1(52.71,59.96) v1(52.71,58.66) v1(52.71,42.21) v1(52.71,40.91) v1(52.71,39.61) v1(52.71,29.77) v1(52.71,28.47) v1(52.71,27.17) v1(53.45,108.72) v1(53.45,107.42) v1(53.45,106.12) v1(54,70.79) v1(54,69.49) v1(54,68.19) v1(54,61.26) v1(54,59.96) v1(54,58.66) v1(54,42.21) v1(54,40.91) v1(54,39.61) v1(54,29.77) v1(54,28.47) v1(54,27.17) v1(54.14,100.38)
PGND: length 181.4
  Top Layer w1: D7.2 12.46,48.69 10,48.69 ; D4.2 57.33,52.39 CN3.2 ; D15.2 57.58,84.79 CN8.2 ; 10,16.05 10.95,15.1 D11.2 ; CN5.2 57.58,19.5 D8.2 ; D3.2 10.95,80.39 10,81.34
  Top Layer w1.5: CN1.1 32.6,11.19 v1(33.68,11.19) v1(34.29,11.19)
  Top Layer w2: 22.21,9.6 19.85,11.96 14.75,11.96 13.33,13.37 13.33,14.95 13.19,15.1
  Bottom Layer w2: H9.3 H6.3 H3.3 2.4,30.55 2.4,95.6 ; H10.3 66.28,95.76 H12.3 H15.3 H18.3
  vias: v1(34.93,11.19) v1(39.62,11.19) v1(40.39,11.19) v1(41.15,11.19)
VIN: length 291.6
  Top Layer w0.254: 46.38,19.01 46.21,19.01 R25.2 45.61,17.11 C23.2 ; 46.38,19.01 v1(47.07,19.01) v1(47.07,17.74) ; 46.38,19.01 46.21,19.19 46.21,19.8 D10.1 ; C38.2 24.73,39.58 R44.2 25.32,41.48 25.5,41.48 ; C37.2 45.61,82.39 R43.2 46.21,84.3 46.38,84.3 ; 45.16,49.89 45.27,50 R17.2 45.86,51.9 46.04,51.9 ; 46.04,51.9 v1(46.73,51.9) v1(46.73,50.63) v1(46.73,49.36) ; 46.04,51.9 45.86,52.08 45.86,52.82 45.74,52.82 45.41,53.15 ; 46.38,84.3 v1(47.07,84.3) 47.05,84.28 v1(47.05,83.03) v1(47.05,81.76) ; 46.38,84.3 46.21,84.48 46.21,85.09 D17.1 ; D18.1 25.32,42.27 25.32,41.66 25.5,41.48 ; 25.5,41.48 v1(26.19,41.48) Q15.2 26.35,40.05 26.35,39
  Top Layer w0.3: C22.2 23.03,48.94 22.92,48.83 22.05,48.83 v1(21.46,48.23) ; 21.78,15.59 v1(21.46,15.59) ; v1(21.46,15.59) 22.05,16.18 22.92,16.18 23.03,16.29 C30.2 ; v1(21.46,15.59) v1(21.46,16.86) Q10.3 ; D14.1 42.36,58.69 v1(42.29,58.69) ; Q11.3 Q11.2 v1(42.29,58.69) ; v1(42.29,58.69) 42.88,59.28 R33.2 43.86,59.4 C31.2 ; C18.2 23.03,81.58 22.92,81.47 22.05,81.47 Q2.1 ; D9.1 21.53,48.23 v1(21.46,48.23) ; D5.1 21.53,80.88 Q2.1 ; v1(21.46,48.23) Q6.2 v1(21.46,50.77) ; Q2.1 Q2.2 ; 21.78,15.2 21.78,14.94 22.78,13.95
  Top Layer w0.5: 29.32,9.6 29.21,9.49 29.21,5.91 28.86,5.57 RN1.8
  Top Layer w0.7: 28.28,32.11 28.37,32.02 28.77,32.02 ; 28.28,32.11 27.69,32.71 27.69,33.43 27.21,33.9 v1(26.71,33.9) ; 28.28,32.11 27.69,31.51 27.69,30.09 26.52,28.92 ; 28.86,32.04 U2.7
  Top Layer w1: SW1.2 32.92,17.32 26.61,11 v1(26.61,9.6) 35.63,9.6 37.08,8.15 C13.1 ; v1(46.8,46.56) 48.07,45.29 48.07,34.34 v1(47.07,33.34) ; v1(21.44,69.27) 21.44,83.39 Q2.3 ; v1(42.27,69.28) v1(42.27,76.47)
  Bottom Layer w1: v1(47.07,33.34) v1(47.07,19.01) v1(47.07,17.74) v1(47.07,16.47) 47.07,10 46.61,9.54 21.84,9.54 21.46,9.92 21.46,18.12 v1(21.47,18.13) 21.44,18.17 21.44,28.67 21.59,28.82 26.16,28.82 26.16,44.34 25.78,44.72 21.84,44.72 21.44,45.13 v1(21.44,49.56) v1(21.44,69.27) ; v1(42.27,69.28) 42.29,69.26 v1(42.29,61.25) 42.29,58.7 v1(42.29,58.69) 42.29,54.76 42.8,54.24 46.35,54.24 46.74,53.86 46.74,46.63 v1(46.8,46.56) ; 47.12,84.35 47.12,76.73 46.86,76.47 v1(42.27,76.47)
  vias: v1(26.17,40.21) v1(26.14,28.92) v1(26.19,38.94) v1(29.21,9.6) v1(34.29,9.6) v1(42.3,59.96)
BOOT: length 70.2
  Top Layer w0.254: BOOT.1 17.65,102.98 14.86,102.98 14.86,102.12 15.41,101.58 C33.2 15.41,100.33 15.32,100.25 ; 15.32,100.25 v1(16.26,100.25) ; 15.32,100.25 15.25,100.25 15.24,100.24 ; 15.32,100.25 R36.2 ; v1(52.78,97.95) 52.78,98.57 Q1.3
  Bottom Layer w0.254: v1(52.78,97.95) 44.08,97.95 43.5,97.37 v1(43.5,92.59) 42.42,92.59 42.16,92.84 42.16,105.55 41.78,105.94 15.88,105.94 15.57,105.63 15.57,100.94 v1(16.26,100.25)
D+: length 18.3
  Top Layer w0.254: USB1.A6 52.4,103.36 v1(51.91,103.84) 51.4,103.33 USB1.B6 ; U5.5 52.96,89.87 v1(52.96,91.84)
  Bottom Layer w0.254: v1(51.91,103.84) 51.79,103.84 51.09,103.14 51.09,101.9 53.37,99.62 53.37,92.24 v1(52.96,91.84)
D-: length 15.1
  Top Layer w0.254: v1(54.23,91.84) 54.22,91.82 U5.6 ; USB1.A7 51.9,102.06 52.34,101.62 v1(52.45,101.62) 52.9,102.06 USB1.B7
  Bottom Layer w0.254: v1(54.23,91.84) 53.72,92.35 53.72,99.97 52.45,101.24 v1(52.45,101.62)
DTR: length 5.4
  Top Layer w0.254: U5.13 51.69,95.61 51.69,97.55 52.2,98.06 Q1.2 52.2,99.44 52.85,100.09 Q1.4
EN: length 57.4
  Top Layer w0.254: v1(25.53,106.57) 25.51,106.56 U6.3 ; v1(51.05,101.11) 51.05,100.73 51.25,100.54 Q1.6 ; v1(8.89,100.25) 8.92,100.21 R40.2 9.85,101.37 C36.2 9.77,101.48 10.29,102 EN.1
  Bottom Layer w0.254: v1(8.89,100.25) 14.38,100.25 14.99,100.86 14.99,105.81 15.75,106.57 v1(25.53,106.57) 44.58,106.57 45.21,105.94 45.21,101.74 45.85,101.11 v1(51.05,101.11)
IO4: length 95.6
  Top Layer w0.254: RN2.3 21.87,7.26 19.94,7.26 19.43,7.76 v1(19.43,9.54) ; 19.43,76.22 v1(19.43,69.23)
  Bottom Layer w0.254: v1(19.43,76.47) 19.43,92.6 24.5,97.67 v1(25.5,97.67) ; v1(19.43,69.23) v1(19.43,9.54)
IO25: length 41.2
  Top Layer w0.254: 47.24,63.53 C29.2 ; 47.24,63.53 v1(47.24,63.52) ; 47.24,63.53 47.24,62.62 ; R29.2 47.18,62.62 ; v1(45.85,77.43) 45.85,69.36 ; U6.28 41.89,96.4 v1(41.58,96.09)
  Bottom Layer w0.254: v1(41.58,96.09) 41.58,78.45 42.04,78 45.21,78 45.85,77.36 ; v1(47.24,63.52) 46.23,63.52 45.85,63.9 45.85,69.36
  vias: v1(45.85,69.28)
IO26: length 63.8
  Top Layer w0.254: v1(20.32,38.88) 20.32,38.75 21,38.07 R39.2 21.81,36.81 21.58,36.58 C35.2 ; 20.32,76.22 v1(20.32,69.23)
  Bottom Layer w0.254: v1(20.32,76.47) 20.32,92.22 24.5,96.4 v1(25.5,96.4) ; v1(20.32,69.23) v1(20.32,38.88)
IO32: length 56.6
  Top Layer w0.254: v1(41.28,49.55) 41.28,48.79 41.57,48.49 R13.2 42.35,47.52 C17.2 ; v1(41.28,69.28) 41.28,76.47 ; U6.30 43.49,98.95 40.64,98.95 v1(40.13,98.44)
  Bottom Layer w0.254: 41.28,76.47 41.28,76.54 40.13,77.68 v1(40.13,98.44) ; v1(41.28,69.28) v1(41.28,49.55)
  vias: v1(41.28,76.47)
IO33: length 91.6
  Top Layer w0.254: v1(41.4,36.88) 41.42,36.86 v1(41.42,34.31) ; v1(40.51,69.28) v1(40.51,76.47) ; v1(39.43,99.01) 40.51,100.09 43.39,100.09 U6.31 ; C21.2 42.69,14.63 R21.2 41.7,15.6 41.4,15.89 v1(41.4,16.53)
  Bottom Layer w0.254: v1(41.4,36.88) 40.51,37.77 v1(40.51,69.28) ; v1(41.4,16.53) 41.42,16.55 v1(41.42,34.31) ; v1(40.51,76.47) 39.43,77.55 v1(39.43,99.01)
IO34: length 83.2
  Top Layer w0.254: 22.61,76.29 v1(22.61,69.23) ; R28.2 26.36,19.52 C28.2 26.43,20.02 27.11,20.02 27.69,20.59 v1(27.69,21.35)
  Bottom Layer w0.254: v1(22.61,69.23) 22.61,46.5 23.37,45.74 26.92,45.74 27.69,44.98 v1(27.69,21.35) ; v1(25.5,95.13) 24.5,95.13 22.61,93.24 v1(22.61,76.47)
IO35: length 22.6
  Top Layer w0.254: U6.29 43.36,97.81 41.15,97.81 v1(40.89,97.55) ; v1(40.89,81.42) 41.43,80.89 R38.2 42.69,79.92 C34.2
  Bottom Layer w0.254: v1(40.89,97.55) v1(40.89,81.42)
IO36: length 11.2
  Top Layer w0.254: R12.2 26.41,84.86 C16.2 26.41,85.85 25.86,86.4 25.86,87.06 25.61,87.31 24.34,87.31 24.26,87.39 v1(24.26,88.54)
  Bottom Layer w0.254: v1(24.26,88.54) 24.26,92.22 24.62,92.59 v1(25.5,92.59)
IO39: length 46.1
  Top Layer w0.254: R20.2 26.41,52.21 C20.2 26.03,53.17 25.78,53.43 25.78,54.24 25.35,54.67 23.84,54.67 v1(23.55,54.96) ; v1(23.55,69.27) 23.55,76.29
  Bottom Layer w0.254: v1(25.5,93.86) 24.5,93.86 23.5,92.85 23.5,76.52 v1(23.55,76.47) ; v1(23.55,69.27) v1(23.55,54.96) ; 23.5,76.34 23.55,76.29
RTS: length 5.7
  Top Layer w0.254: U5.14 50.41,97.16 51.55,98.3 Q1.1 51.56,98.65 51.56,99.46 52.2,100.09 Q1.5
SCL: length 93.6
  Top Layer w0.254: v1(27.52,76.85) 27.43,76.77 27.43,57.93 28.32,57.04 v1(28.45,57.04) 29.64,57.04 ; U6.36 43.49,106.57 29.97,106.57 27.43,104.03 v1(27.43,94.38)
  Bottom Layer w0.254: U7.23 32.14,56.08 31.52,56.08 30.56,57.04 29.64,57.04 ; U1.26 30.18,78.07 28.96,76.85 v1(27.52,76.85) 27.43,76.94 v1(27.43,94.38) ; v1(28.45,57.04) 28.34,56.93 28.34,39.75 29.84,38.25 U4.26
  vias: v1(29.69,57.04)
SDA: length 93.6
  Top Layer w0.254: v1(28.19,94.38) 28.19,103.78 30.35,105.94 40.39,105.94 40.64,105.68 40.64,103.01 41.02,102.63 43.39,102.63 U6.33 ; v1(28.19,77.44) 28.23,77.4 28.23,58.06 28.48,57.8 v1(29.69,57.8)
  Bottom Layer w0.254: v1(28.19,94.38) v1(28.19,77.44) 28.78,77.44 30.07,78.72 U1.27 ; U4.27 30.08,38.9 29.1,39.88 29.1,57.55 29.36,57.8 v1(29.69,57.8) 30.48,57.8 31.78,56.5 U7.24
SERVO0: length 41.6
  Bottom Layer w0.254: U1.22 12.81,75.47 10.54,77.74 10.54,93.98 8.64,95.88 H1.1
SERVO1: length 39.2
  Bottom Layer w0.254: H4.1 8.64,92.73 9.91,91.46 9.91,77.49 12.57,74.82 U1.21
SERVO2: length 36.8
  Bottom Layer w0.254: U1.20 12.33,74.17 9.27,77.23 9.27,88.94 8.64,89.57 H7.1
SERVO3: length 31.9
  Bottom Layer w0.254: U1.19 31.01,73.55 12.36,73.55 9.27,70.47 9.27,63.83 8.64,63.19 H2.1
SERVO4: length 34.2
  Bottom Layer w0.254: U1.18 31,72.92 12.7,72.92 9.91,70.12 9.91,61.31 8.64,60.04 H5.1
SERVO5: length 36.5
  Bottom Layer w0.254: U1.17 12.94,72.22 10.54,69.83 10.54,58.79 8.64,56.89 H8.1
SERVO6: length 62.2
  Bottom Layer w0.254: 7.31,30.38 8.51,30.38 11.3,33.17 11.3,69.7 13.17,71.57 U1.16
SERVO7: length 64.5
  Bottom Layer w0.254: 7.31,27.27 8.51,27.27 12.03,30.79 12.03,69.58 13.35,70.9 31.02,70.9 U1.15
SERVO8: length 77.5
  Bottom Layer w0.254: 7.31,24.16 8.5,24.16 8.51,24.15 8.76,24.15 12.83,28.21 12.83,69.49 13.59,70.25 31.74,70.25 32.22,70.72 32.22,73.64 34.71,76.12 U1.6
SERVO9: length 41.5
  Bottom Layer w0.254: 37.5,75.48 55.73,75.48 58.04,77.79 58.04,93.87 59.94,95.78 61.1,95.78 H10.1
SERVO10: length 39.2
  Bottom Layer w0.254: 58.64,77.49 58.64,91.46 59.91,92.73 61.12,92.73 ; 37.5,74.83 55.97,74.83 58.64,77.49
SERVO11: length 36.8
  Bottom Layer w0.254: 61.12,89.57 59.91,89.57 59.28,88.94 59.28,77.23 ; 37.5,74.18 56.21,74.18 59.27,77.24
SERVO12: length 31.8
  Bottom Layer w0.254: H11.1 60.18,62.93 59.44,63.68 59.44,70.31 56.25,73.5 37.59,73.5
SERVO13: length 34.1
  Bottom Layer w0.254: 37.61,72.87 55.91,72.87 58.7,70.07 58.7,61.26 60.11,59.85 H14.1
SERVO14: length 36.7
  Bottom Layer w0.254: U1.12 55.62,72.22 57.91,69.93 57.91,58.89 60.02,56.79 61.19,56.79 61.24,56.84
SERVO15: length 28.3
  Bottom Layer w0.254: H12.1 61.19,30.37 59.94,30.37 59.06,31.26 59.06,34.82 57.57,36.3 U4.6
SERVO16: length 30.6
  Bottom Layer w0.254: U4.7 57.46,35.65 58.42,34.69 58.42,28.85 59.94,27.32 H15.1
SERVO17: length 33.1
  Bottom Layer w0.254: H18.1 61.08,24.15 59.94,24.15 57.78,26.31 57.78,34.43 57.22,35 U4.8
U0_RXD: length 39.2
  Top Layer w0.254: U5.2 v1(49.13,91.84) ; RXD.1 22.24,104.14 v1(22.22,104.16) ; 47.05,92.92 45.47,94.51 45.47,103.27 44.83,103.9 43.62,103.9 U6.34 43.36,104.16 v1(41.4,104.16)
  Bottom Layer w0.254: 47.05,92.92 48.13,91.84 v1(49.13,91.84) ; v1(41.4,104.16) v1(22.22,104.16)
  vias: v1(47.17,92.92)
U0_TXD: length 43
  Top Layer w0.254: v1(22.22,104.92) 22.22,105.39 22.24,105.41 TXD.1 ; v1(41.4,105.29) U6.35 44.85,105.29 46.5,103.63 46.5,95.18 v1(47.17,94.51) ; v1(50.42,91.84) 50.41,91.82 U5.3
  Bottom Layer w0.254: v1(50.42,91.84) 49.96,91.84 47.29,94.51 v1(47.17,94.51) ; v1(41.4,105.29) 41.04,104.92 v1(22.22,104.92)
VOUT1: length 9.2
  Top Layer w0.8: CN2.1 10.95,84.79 D3.1 15.92,84.79 Q2.9
VOUT2: length 9.2
  Top Layer w0.8: CN4.1 10.95,52.14 D7.1 15.92,52.14 Q6.9
VOUT3: length 9.2
  Top Layer w0.8: Q10.9 15.92,19.5 D11.1 10.95,19.5 CN6.1
VOUT4: length 9.2
  Top Layer w0.8: CN8.1 57.58,80.39 D15.1 52.6,80.39 Q14.9
VOUT5: length 9.4
  Top Layer w0.8: Q3.9 52.26,47.99 D4.1 57.83,47.99 CN3.1
VOUT6: length 9.2
  Top Layer w0.8: CN5.1 57.58,15.1 D8.1 52.6,15.1 Q7.9
VOUT7: length 9.2
  Top Layer w0.8: Q11.9 36.75,62.6 D12.1 31.78,62.6 CN7.1
VOUT8: length 9.2
  Top Layer w0.8: CN9.1 36.7,37.57 D16.1 31.72,37.57 Q15.9
$1N5663: length 4.7
  Top Layer w0.3: USB1.A5 53.4,101.05 53.47,100.98 55.37,100.98 55.5,100.86 R10.1
$1N5825: length 2.7
  Top Layer w0.3: R11.1 50.4,100.12 USB1.B5
$1N9225: length 7.8
  Bottom Layer w0.254: U1.23 33.56,76.12 35.13,77.69 R2.1
$1N11453: length 2.6
  Bottom Layer w0.254: C24.1 30.77,55.77 31.24,55.77 31.42,55.59 31.42,54.7 31.62,54.5 32.22,54.5 U7.20
$1N12575: length 10.2
  Top Layer w0.254: C14.2 54.17,98.21 52.32,96.36 52.32,94.63 51.68,93.98 U5.4
$1N38845: length 7.5
  Top Layer w0.254: Q2.4 22.47,84.69 22.87,84.29 22.87,84.15 C18.1 24.12,81.81 R16.1 25.38,79.87 25.38,79.63
$1N38859: length 2.7
  Top Layer w0.254: 24.89,85.82 R14.2 ; 24.89,85.82 Q4.1 ; 24.89,85.82 24.97,85.74 R12.1
$1N41287: length 17.1
  Top Layer w1: L1.1 30.35,23.77 28.81,25.31 C3.2
  Top Layer w1.5: 36.23,28.36 37.29,29.42 37.29,30.76 ; L1.1 33.34,23.77 36.24,26.67 D1.1
$1N41288: length 15.3
  Top Layer w0.254: R6.1 38.72,27.85 38.35,28.21 38.35,31.77 38.08,32.04 U2.2
  Top Layer w0.3: 37.22,32.08 36.79,32.08 35.41,30.7 33.08,30.7 32.38,31.39 30.23,31.39 29.99,31.15 28.81,31.15
$1N41290: length 2
  Top Layer w0.5: U2.3 38.93,33.31 39.19,33.57
$1N41291: length 1.6
  Top Layer w0.8: R1.1 C1.1
$1N41292: length 6.6
  Top Layer w0.7: 40.63,33.43 40.62,33.44 40.62,34.04 40.08,34.58 U2.4 ; 40.63,33.43 42.12,33.43 42.72,34.03 ; 40.63,33.43 R7.1
$1N41293: length 2.9
  Top Layer w0.8: 31.26,30.72 30.25,29.72 C3.1
$1N41296: length 2.4
  Top Layer w0.7: R4.1 31.25,33.31
$1N41309: length 7
  Top Layer w1: SW1.3 36.38,14.74 36.38,12.41 37.09,11.7
$1N45172: length 8
  Bottom Layer w0.254: 35.06,40.94 35.18,40.83 35.18,37.73 33.75,36.31 30.98,36.31
$1N60250: length 2.8
  Top Layer w0.254: 43.22,46.91 43.23,46.89 ; 43.22,46.91 43.22,48.49 ; 43.22,46.91 43.27,46.96 Q5.1
$1N60800: length 7.5
  Top Layer w0.254: 25.38,46.99 25.38,47.23 R24.1 24.12,49.16 C22.1 22.87,51.5 22.87,51.64 22.47,52.04 Q6.4
$1N60819: length 2.7
  Top Layer w0.254: 24.89,53.18 R22.2 ; 24.89,53.18 Q8.1 ; 24.89,53.18 24.97,53.1 R20.1
$1N61369: length 8.1
  Top Layer w0.254: D10.2 44.09,20.25 44.65,19.7 44.65,18.52 R25.1 44.41,18.08 C23.1 45.66,15.74 R27.2 46.67,15.6 Q7.4
$1N61388: length 2.8
  Top Layer w0.254: 43.56,14.01 43.61,14.07 Q9.1 ; 43.56,14.01 43.57,14 ; 43.56,14.01 R21.1
$1N61938: length 7.5
  Top Layer w0.254: 25.38,14.34 25.38,14.59 R32.1 24.12,16.52 C30.1 22.81,18.91 22.81,19.06 22.47,19.4 Q10.4
$1N61957: length 2.7
  Top Layer w0.254: 24.89,20.53 24.97,20.45 R28.1 ; 24.89,20.53 Q12.1 ; 24.89,20.53 R30.2
$1N62507: length 7.5
  Top Layer w0.254: D14.2 46.21,57.69 R33.1 44.95,59.62 C31.1 43.69,61.96 R35.2 43.29,62.5 Q11.4
$1N62526: length 2.7
  Top Layer w0.254: Q13.1 45.72,63.63 ; 45.72,63.63 45.8,63.55 R29.1 ; 45.72,63.63 R31.2
$1N63076: length 8.1
  Top Layer w0.254: Q14.4 46.67,80.89 R45.2 45.66,81.03 C37.1 44.41,83.37 R43.1 44.65,83.81 44.65,84.99 44.09,85.54 D17.2
$1N63095: length 2.8
  Top Layer w0.254: 43.56,79.3 43.61,79.35 Q16.1 ; 43.56,79.3 R38.1 ; 43.56,79.3 43.57,79.29
$1N63645: length 8.1
  Top Layer w0.254: 26.19,37.67 25.79,38.07 R46.2 24.78,38.21 C38.1 23.53,40.55 R44.1 23.76,40.99 23.76,42.17 23.21,42.72 D18.2
$1N63664: length 2.8
  Top Layer w0.254: 22.68,36.48 22.73,36.54 Q17.1 ; 22.68,36.48 R39.1 ; 22.68,36.48 R42.2
$1N80892: length 0.8
  Top Layer w0.5: RN1.2 RN1.1
$1N80896: length 0.8
  Top Layer w0.5: RN1.6 RN1.7
$1N80957: length 0.8
  Top Layer w0.5: RN2.6 RN2.7
$1N80959: length 0.8
  Top Layer w0.5: RN2.2 RN2.1
$1N80966: length 1.7
  Top Layer w0.5: RN2.8 RN1.5
$1N80970: length 0.8
  Top Layer w0.5: RN1.4 RN1.3
$1N81207: length 11
  Top Layer w0.254: TXD.2 v1(21.17,104.78) RXD.2 21.17,103.3 R37.2 ; 3V3.2 v1(17.75,104.78) BOOT.2
  Bottom Layer w0.254: v1(17.75,104.78) v1(21.17,104.78)
$1N103599: length 8.1
  Top Layer w0.254: D6.2 43.75,53.15 44.3,52.6 44.3,51.41 R17.1 44.07,50.97 C19.1 45.32,48.63 R19.2 46.33,48.49 46.73,48.09
$1N103817: length 2.5
  Top Layer w0.254: Q8.3 22.53,53.12 23.73,51.92 R26.1
$1N104041: length 2.5
  Top Layer w0.254: Q12.3 22.53,20.47 23.73,19.28 R34.1
$1N104265: length 3
  Top Layer w0.254: R45.1 44.77,80.86 44.77,80.04 44.95,79.86 45.71,79.86 45.91,79.66 45.91,78.94 Q16.3
$1N104489: length 3
  Top Layer w0.254: Q5.3 45.57,46.54 45.57,47.26 45.37,47.46 44.61,47.46 44.43,47.64 44.43,48.47 R19.1
$1N104713: length 3
  Top Layer w0.254: Q9.3 45.91,13.65 45.91,14.37 45.71,14.57 44.95,14.57 44.77,14.75 44.77,15.57 R27.1
$1N104937: length 2.5
  Top Layer w0.254: R35.1 44.56,62.38 43.36,63.58 Q13.3
$1N105161: length 3
  Top Layer w0.254: R46.1 23.89,38.04 23.89,37.22 24.07,37.04 24.83,37.04 25.03,36.84 25.03,36.12 Q17.3
$1N105996: length 2.5
  Top Layer w0.254: R18.1 23.73,84.56 22.53,85.76 Q4.3
$1N116707: length 2.1
  Bottom Layer w0.254: U7.10 36.23,55.01 36.78,55.01 36.96,55.19 36.96,55.54 37.21,55.8 C26.2

## Copper pours and planes (outline as drawn; the poured copper is in the pictures)
GND on Top Layer: -19.18,120.67 71.25,120.67 71.25,-4.55 -19.18,-4.55
GND on Bottom Layer: -3.56,112.54 83.82,112.54 83.82,-12.17 -3.56,-12.17
PGND on Top Layer: 50.93,11.96 50.93,1.03 28.02,1.03 28.2,11.96
PGND on Top Layer: -2.79,98.51 9.02,98.51 8.89,5.1 60.07,5.1 60.1,98.38 73.41,98.38 73.41,-6.65 -10.16,-6.65 -10.16,98.63 -2.92,98.63
PGND on Bottom Layer: -0.51,97.81 11.3,97.81 11.3,13.73 62.38,13.73 62.38,97.68 75.69,97.68 75.69,-7.35 -7.87,-7.35 -7.87,97.93 -0.64,97.93
PGND on Bottom Layer: -0.76,97.68 6.22,97.68 6.22,13.61 59.34,13.61 59.34,97.55 75.44,97.55 75.44,-7.48 -8.13,-7.48 -8.13,97.81 -0.89,97.81

## Text on the board
Bottom Silkscreen Layer: ControlUnit | SpaceHexapod
Top Silkscreen Layer: EN | BOOT | 3V3 | TXD | RXD | - | ON | +
